# EAGLE design sa612_rcvr (EAGLE 9.6.2)
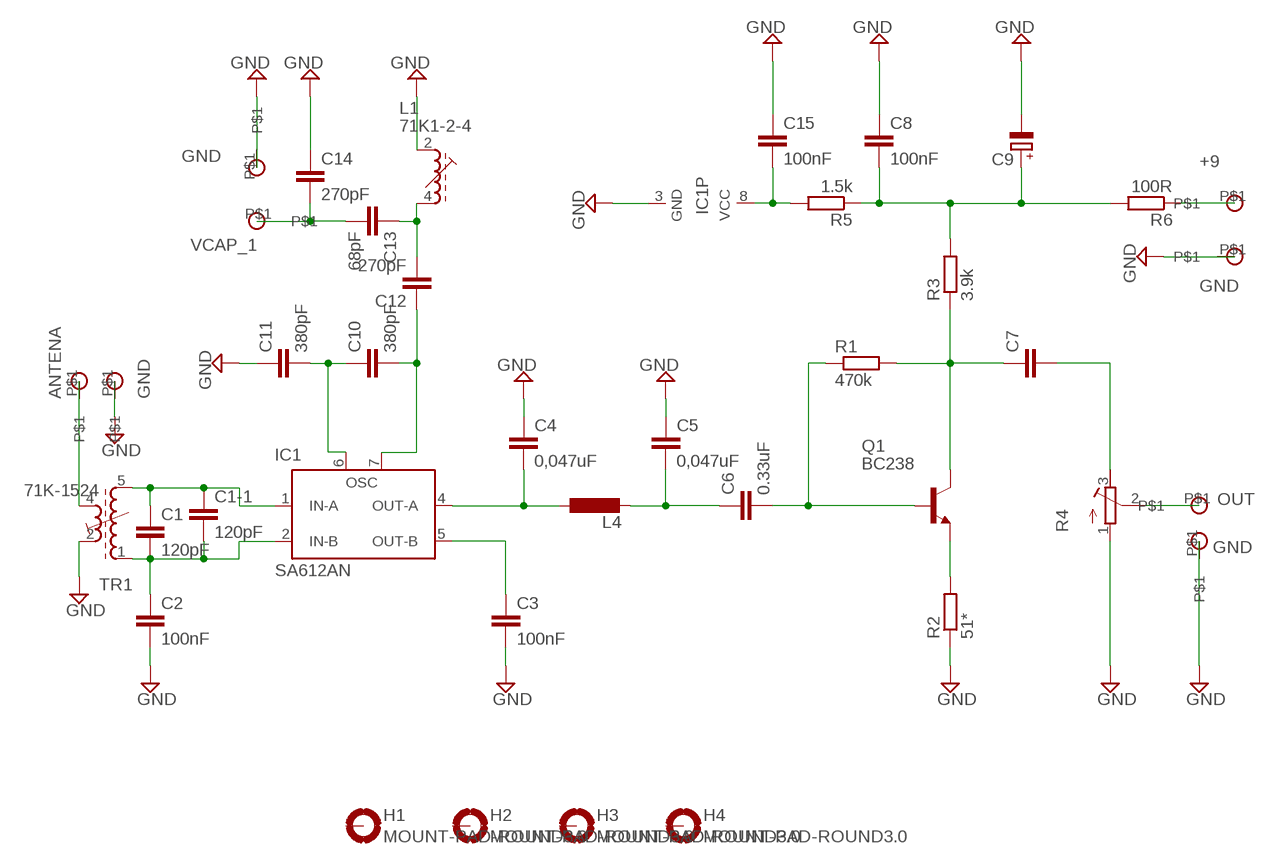
[diagram p0: schematic, sheet 1]

## Parts
C1  120pF  C-EUC0805K  [C0805K]
C1-1  120pF  C-EU050-025X075  [C050-025X075]
C2  100nF  C-EUC0805K  [C0805K]
C3  100nF  C-EUC0805K  [C0805K]
C4  0,047uF  C-EUC0805K  [C0805K]
C5  0,047uF  C-EUC0805K  [C0805K]
C6  0.33uF  C-EUC0805K  [C0805K]
C7  C-EU050-025X075  [C050-025X075]
C8  100nF  C-EUC0805K  [C0805K]
C9  CPOL-EUE5-8.5  [E5-8,5]
C10  380pF  C-EUC0805K  [C0805K]
C11  380pF  C-EUC0805K  [C0805K]
C12  270pF  C-EUC0805K  [C0805K]
C13  68pF  C-EUC0805K  [C0805K]
C14  270pF  C-EUC0805K  [C0805K]
C15  100nF  C-EUC0805K  [C0805K]
H1  MOUNT-PAD-ROUND3.0  [3,0-PAD]
H2  MOUNT-PAD-ROUND3.0  [3,0-PAD]
H3  MOUNT-PAD-ROUND3.0  [3,0-PAD]
H4  MOUNT-PAD-ROUND3.0  [3,0-PAD]
IC1  SA612AN  [DIL08]
L1  71K1-2-4  [71K]
L4  L-EU6000-XXX-RC  [6000-XXXX-RC]
Q1  BC238  [TO92]
R1  470k  R-EU_R0805  [R0805]
R2  51*  R-EU_R0805  [R0805]
R3  3.9k  R-EU_R0805  [R0805]
R4  R-TRIMM64X  [RTRIM64X]
R5  1.5k  R-EU_R0805  [R0805]
R6  100R  R-EU_R0805  [R0805]
TR1  71K-1524  [71K]
U$1  SMD_PIN  [SMD_PIN]
U$2  SMD_PIN  [SMD_PIN]
U$3  SMD_PIN  [SMD_PIN]
U$4  SMD_PIN  [SMD_PIN]
U$5  SMD_PIN  [SMD_PIN]
U$6  SMD_PIN  [SMD_PIN]
U$7  SMD_PIN  [SMD_PIN]
U$8  SMD_PIN  [SMD_PIN]

## Nets
+9: R6.1 U$5.P$1
ANTENA: TR1.4(E2) U$3.P$1
GND: C2.2 C3.2 C4.1 C5.1 C8.1 C9.- C11.1 C14.1 C15.1 IC1.3(GND) L1.2(A) R2.1 R4.1(A) TR1.2(A2) U$2.P$1 U$4.P$1 U$6.P$1 U$8.P$1
N$1: C1-1.1 C1.1 IC1.1(IN-A) TR1.5(E1)
N$2: C1-1.2 C1.2 C2.1 IC1.2(IN-B) TR1.1(A1)
N$4: C3.1 IC1.5(OUT-B)
N$5: C4.2 IC1.4(OUT-A) L4.1
N$6: C5.2 C6.1 L4.2
N$7: C6.2 Q1.2(B) R1.1
N$8: Q1.1(E) R2.2
N$9: C7.1 Q1.3(C) R1.2 R3.1
N$10: C7.2 R4.3(E)
N$12: C15.2 IC1.8(VCC) R5.2
N$13: C8.2 C9.+ R3.2 R5.1 R6.2
N$15: C10.1 C11.2 IC1.6(OSC)
N$16: C10.2 C12.1 IC1.7(OSC')
N$17: C12.2 C13.1 L1.4(E)
OUT: R4.2(S) U$1.P$1
VCAP_1: C13.2 C14.2 U$7.P$1
Unconnected: H1.B3,0(MOUNT) H2.B3,0(MOUNT) H3.B3,0(MOUNT) H4.B3,0(MOUNT) L1.S1 L1.S2 TR1.S1 TR1.S2

## Library data of the parts
C1 C1-1 C2-C8 C10-C15 = rcl:C-EU: CAPACITOR, European symbol; SPICEPREFIX: C
C9 = rcl:CPOL-EU: POLARIZED CAPACITOR, European symbol; SPICEPREFIX: C
H1-H4 = holes:MOUNT-PAD-ROUND: MOUNTING PAD, round
IC1 = linear:SA612A: Double-balanced mixer and oscillator NE612/SA612 Source: www-eu2.semiconductors.philips.com/acrobat/datasheets/SA612A.pdf
L1 = inductor-neosid:71K1-: FILTER adjustable filter coil, type K; OC_FARNELL: unknown; OC_NEWARK: unknown
L4 = rcl:L-EU: INDUCTOR, European symbol; SPICEPREFIX: L
Q1 = transistor-npn:BC238: NPN Transistor
R1-R3 R5 R6 = rcl:R-EU_: RESISTOR, European symbol; SPICEPREFIX: R
R4 = rcl:R-TRIMM: Trimm resistor; SPICEMODEL: X; SPICEPREFIXL: POT
TR1 = inductor-neosid:71K-: TRANSFORMER adjustable filter transformer, type K; OC_FARNELL: unknown; OC_NEWARK: unknown
U$1-U$8 = mylib:SMD_PIN

## Board
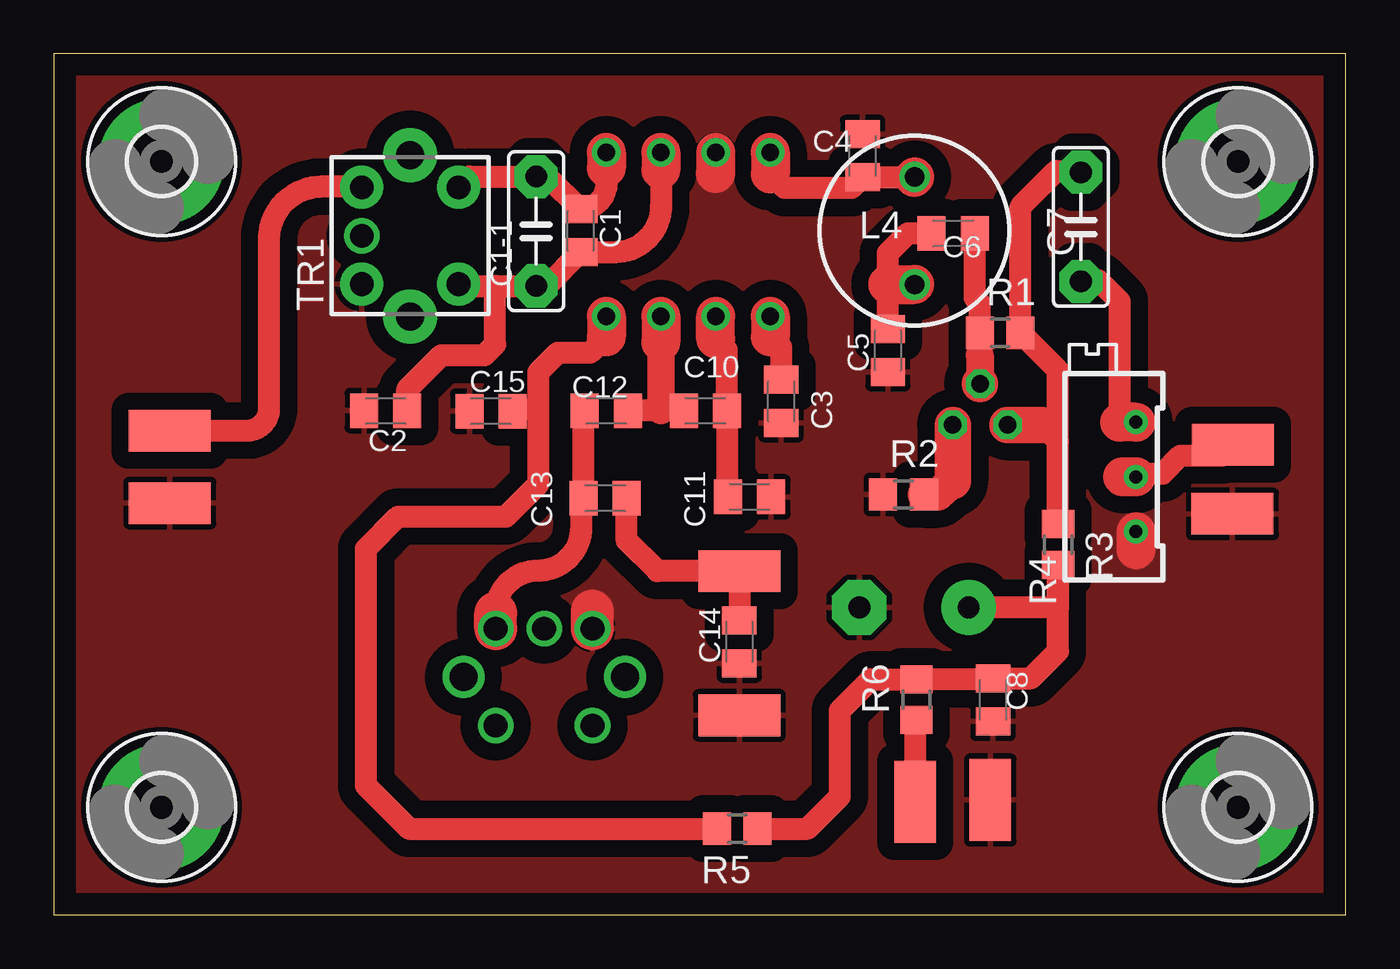
[diagram p1: board, top side]
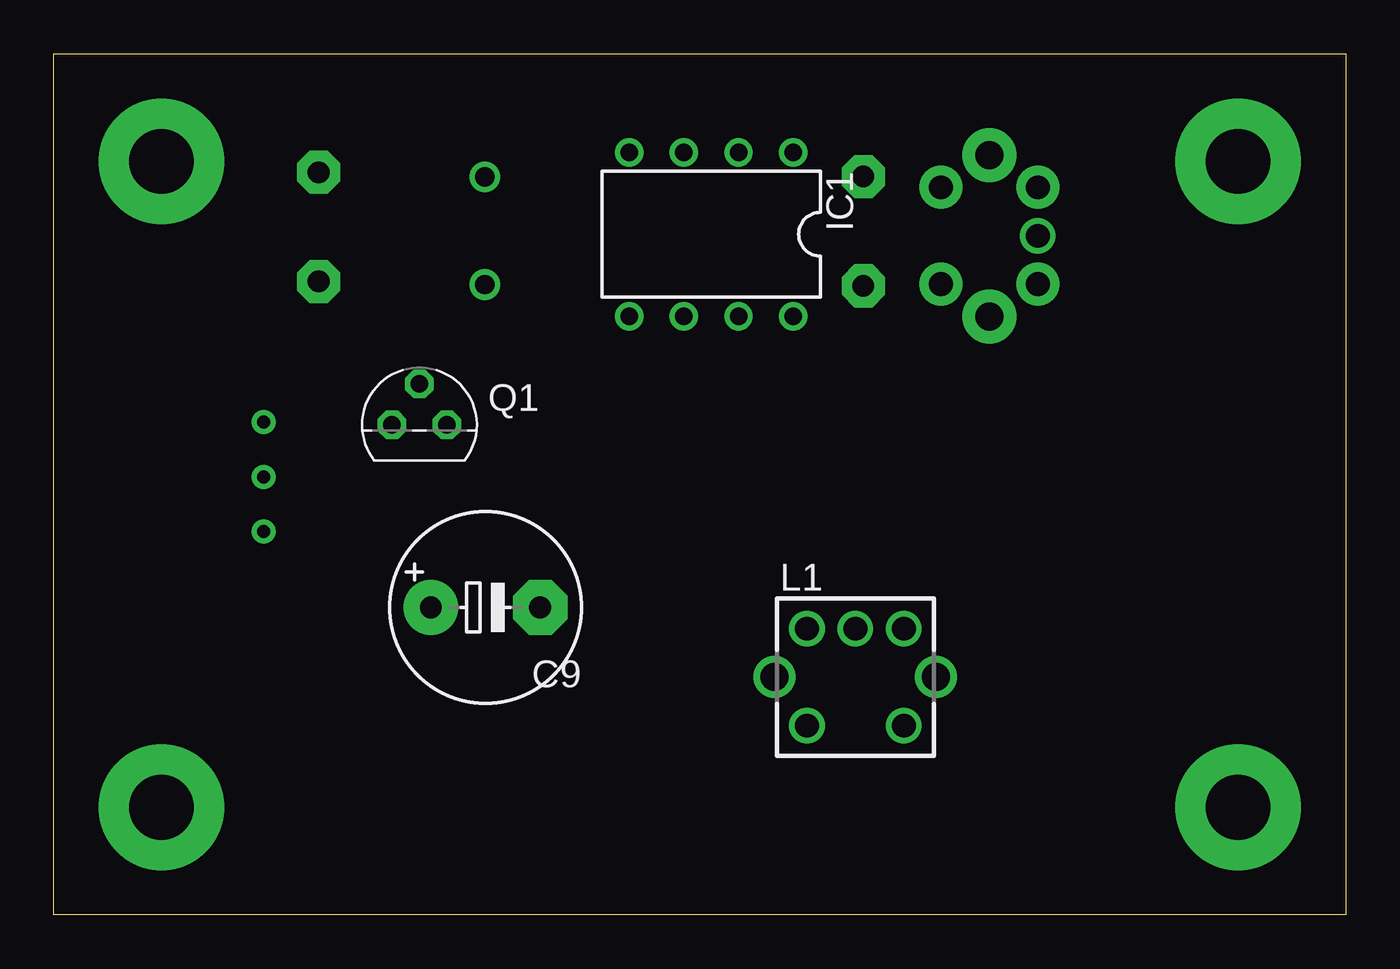
[diagram p2: board, bottom side, seen from below]

Size 60 x 40 mm. Coordinates in mm from the lower left corner, seen from the top.
Outline: 0,0 60,0 60,40 0,40 0,0
Copper layers (1*16): Top 0.035mm / dielectric 1.5mm / Bottom 0.035mm
Design rules "default": minimum track width 6mil, minimum drill 0.35mm, track to track 6mil, track to pad 6mil, pad to pad 6mil, via to via 6mil, smd to smd 6mil, copper to edge 40mil, drill to drill 6mil, minimum pad ring 10mil, minimum via ring 8mil, stop-mask expansion 4mil, vias tented up to drill 0mil, thermal gap 10mil

### Footprints (pad centres in the part's own frame; a part is rotated, then mirrored left to right if it is on the bottom)
C0805K = smd 1.3 x 1.6: 1 -1,0; 2 1,0
C050-025X075 = drill 1 pad 2 octagon: 1 -2.54,0; 2 2.54,0
E5-8,5 = drill 1.016 pad 2.54: + -2.54,0 | drill 1.016 pad 2.54 octagon: - 2.54,0
3,0-PAD = drill 3 pad 5.842: B3,0 0,0
DIL08 = drill 0.813 pad 1.27: 1 -3.81,-3.81; 2 -1.27,-3.81; 3 1.27,-3.81; 4 3.81,-3.81; 5 3.81,3.81; 6 1.27,3.81; 7 -1.27,3.81; 8 -3.81,3.81
71K = drill 1.1: 1 -2.25,-2.25; 2 -2.25,2.25; 3 0,2.25; 4 2.25,2.25; 5 2.25,-2.25 | drill 1.3: S1 -3.75,0; S2 3.75,0
6000-XXXX-RC = drill 0.9 pad 1.422: 1 -2.5,0; 2 2.5,0
TO92 = drill 0.813 octagon: 1 1.27,0; 2 0,1.905; 3 -1.27,0
R0805 = smd 1.3 x 1.5: 1 -0.95,0; 2 0.95,0
RTRIM64X = drill 0.61: 1 1.27,-2.54; 2 1.27,0; 3 1.27,2.54
71K' = drill 1.1 pad 2: 1 -2.25,-2.25; 2 -2.25,2.25; 4 2.25,2.25; 5 2.25,-2.25 | drill 1.1: 3 0,2.25 | drill 1.3 pad 2.5: S1 -3.75,0; S2 3.75,0
SMD_PIN = smd 1.93 x 3.81: P$1 0,0

### Placement (x,y rotation side)
C1  24.46,31.78 270 top
C1-1  22.4,31.76 270 top
C2  15.41,23.42 180 top
C3  33.78,23.86 270 top
C4  37.56,35.26 270 top
C5  38.74,26.22 90 top
C6  41.77,31.66 0 top
C7  47.7,31.96 270 top
C8  43.62,9.99 90 top
C9  39.95,14.28 0 bottom
C10  30.26,23.42 180 top
C11  32.31,19.42 180 top
C12  25.66,23.42 180 top
C13  25.61,19.36 0 top
C14  31.84,12.69 90 top
C15  20.3,23.4 0 top
H1  5,5 0 top
H2  55,5 0 top
H3  5,35 0 top
H4  55,35 0 top
IC1  29.47,31.62 180 bottom
L1  22.77,11.05 0 bottom
L4  39.98,31.78 270 top
Q1  43.02,22.76 0 bottom
R1  43.95,27.04 0 top
R2  39.46,19.53 0 top
R3  46.64,17.2 270 top
R4  48.99,20.35 0 top
R5  31.74,4.01 180 top
R6  40.06,10 90 top
TR1  71K-1524  [71K']  16.55,31.55 90 top
U$1  54.76,21.83 270 top
U$2  54.74,18.63 90 top
U$3  5.39,22.49 90 top
U$4  5.39,19.13 90 top
U$5  40.01,5.26 0 top
U$6  31.84,9.27 90 top
U$7  31.84,15.97 270 top
U$8  43.49,5.34 0 top

### Tracks (layer width: path | path; a pad name or v marks a point on that pad's centre or on a via)
+9
  Top 1.016: U$5.P$1 40.01,9 R6.1
ANTENA
  Top 1.016: U$3.P$1 8.96,22.49 arc90 10,23.53 10,31.39 arc-90 12.44,33.83 14.27,33.83 TR1.4
GND
  Top 1.8: R4.1 50.26,16.96 | IC1.3 30.74,34.45 arc-90 30.73,34.44 | 25.02,14.12 25.05,14.15
  Top 2: L1.2 25.02,14.12
  pour Top (isolate 0.8): -1.5,41.5 -1.5,-1.5 61.5,-1.5 61.5,41.5
N$1
  Top 1.016: 24.46,32.92 C1.1 | TR1.5 19.3,34.3 C1-1.1 22.94,34.3 C1.1 | 25.67,34.69 25.67,33.99 arc-90 C1.1
  Top 1.8: IC1.1 25.66,34.7 25.67,34.69
N$2
  Top 1.016: C2.1 16.41,24.41 18,26 20,26 20.5,26.5 20.5,29.22 | TR1.1 18.88,29.22 20.5,29.22 | 20.5,29.22 C1-1.2 22.9,29.22 C1.2 26.06,30.78 arc90 28.2,32.92 28.2,34.6
  Top 1.8: IC1.2 28.2,34.6
N$4
  Top 1.016: 33.28,26.86 33.78,26.36 C3.1
  Top 1.8: IC1.5 33.28,26.86
N$5
  Top 1.016: 33.28,34.43 33.95,33.76 37.06,33.76 C4.2 39.96,34.26
  Top 1.8: IC1.4 33.28,34.43 | 39.96,34.26 L4.1
N$6
  Top 1.016: 38.74,29.28 C5.2 38.74,30.74 39.66,31.66 C6.1
  Top 1.8: 38.74,29.28 L4.2
N$7
  Top 1.016: R1.1 43,28.43 42.77,28.66 C6.2 | 43.02,27.02 R1.1 | R1.1 43,26
  Top 1.3: 43,26 43,24.68
  Top 1.7: 43,24.68 Q1.2
N$8
  Top 1.5: R2.2 41.05,19.53 41.75,20.15
  Top 1.7: Q1.1 41.75,20.15
N$9
  Top 1.016: R3.1 46.64,22 | 46.64,22 46.64,25.3 R1.2 44.9,32.9 46.55,34.55 47.65,34.55 C7.1 | 45.88,22.76 46.64,22
  Top 1.7: Q1.3 45.88,22.76
N$10
  Top 1.016: 49.5,22.89 49.5,28.5 48.53,29.47 47.75,29.47 C7.2
  Top 1.8: R4.3 49.5,22.89
N$12
  Top 1.016: R5.2 16.49,4.01 14.5,6 14.5,17 16,18.5 21,18.5 22.5,20 22.5,23.5 | 25.66,26.86 24.9,26.1 23.4,26.1 22.5,25.2 22.5,23.5 | C15.2 arc-90 21.4,23.5 22.5,23.5
  Top 1.8: IC1.8 25.66,26.86
N$13
  Top 1.016: R5.1 35.01,4.01 36.5,5.5 36.5,9.5 37.95,10.95 R6.2 43.62,10.95 C8.2 45.38,10.99 46.64,12.25 R3.2 46.64,14.28 C9.+
N$15
  Top 1.016: 30.74,26.76 31.26,26.24 C10.1 31.26,19.25 C11.2
  Top 1.8: 30.74,26.76 IC1.6
N$16
  Top 1.016: C10.2 28.2,23.42 C12.1
  Top 1.27: 28.2,26.6 28.2,23.42
  Top 1.8: IC1.7 28.2,26.6
N$17
  Top 1.016: C12.2 24.61,23.37 C13.1 arc90 24.5,19.25 24.5,18 arc-90 22.5,16 arc90 20.52,14.02
  Top 2: L1.4 20.52,14.02
OUT
  Top 1.016: U$1.P$1 54.26,21.33 52.33,21.33 51.5,20.5 50.41,20.5 R4.2
  Top 1.8: R4.2 49.65,20.35
VCAP_1
  Top 1.016: C14.2 U$7.P$1 28.03,15.97 26.61,17.39 C13.2